# Altium schematic sheet DA +10,-10.SchDoc
size A3; PageSetup: Record=PageOptions|CenterHorizontal=True|CenterVertical=True|PrintScale=1.01|XCorrection=1.00|YCorrection=1.00|PrintKind=1|BorderSize=5000000|LeftOffset=0|BottomOffset=0|Orientation=2|PaperLength=1000|PaperWidth=1000|Scale=100|PaperSource=7|PrintQuality=-4|MediaType=1|DitherType=10|PaperKind=A3|PrintScaleMode=1
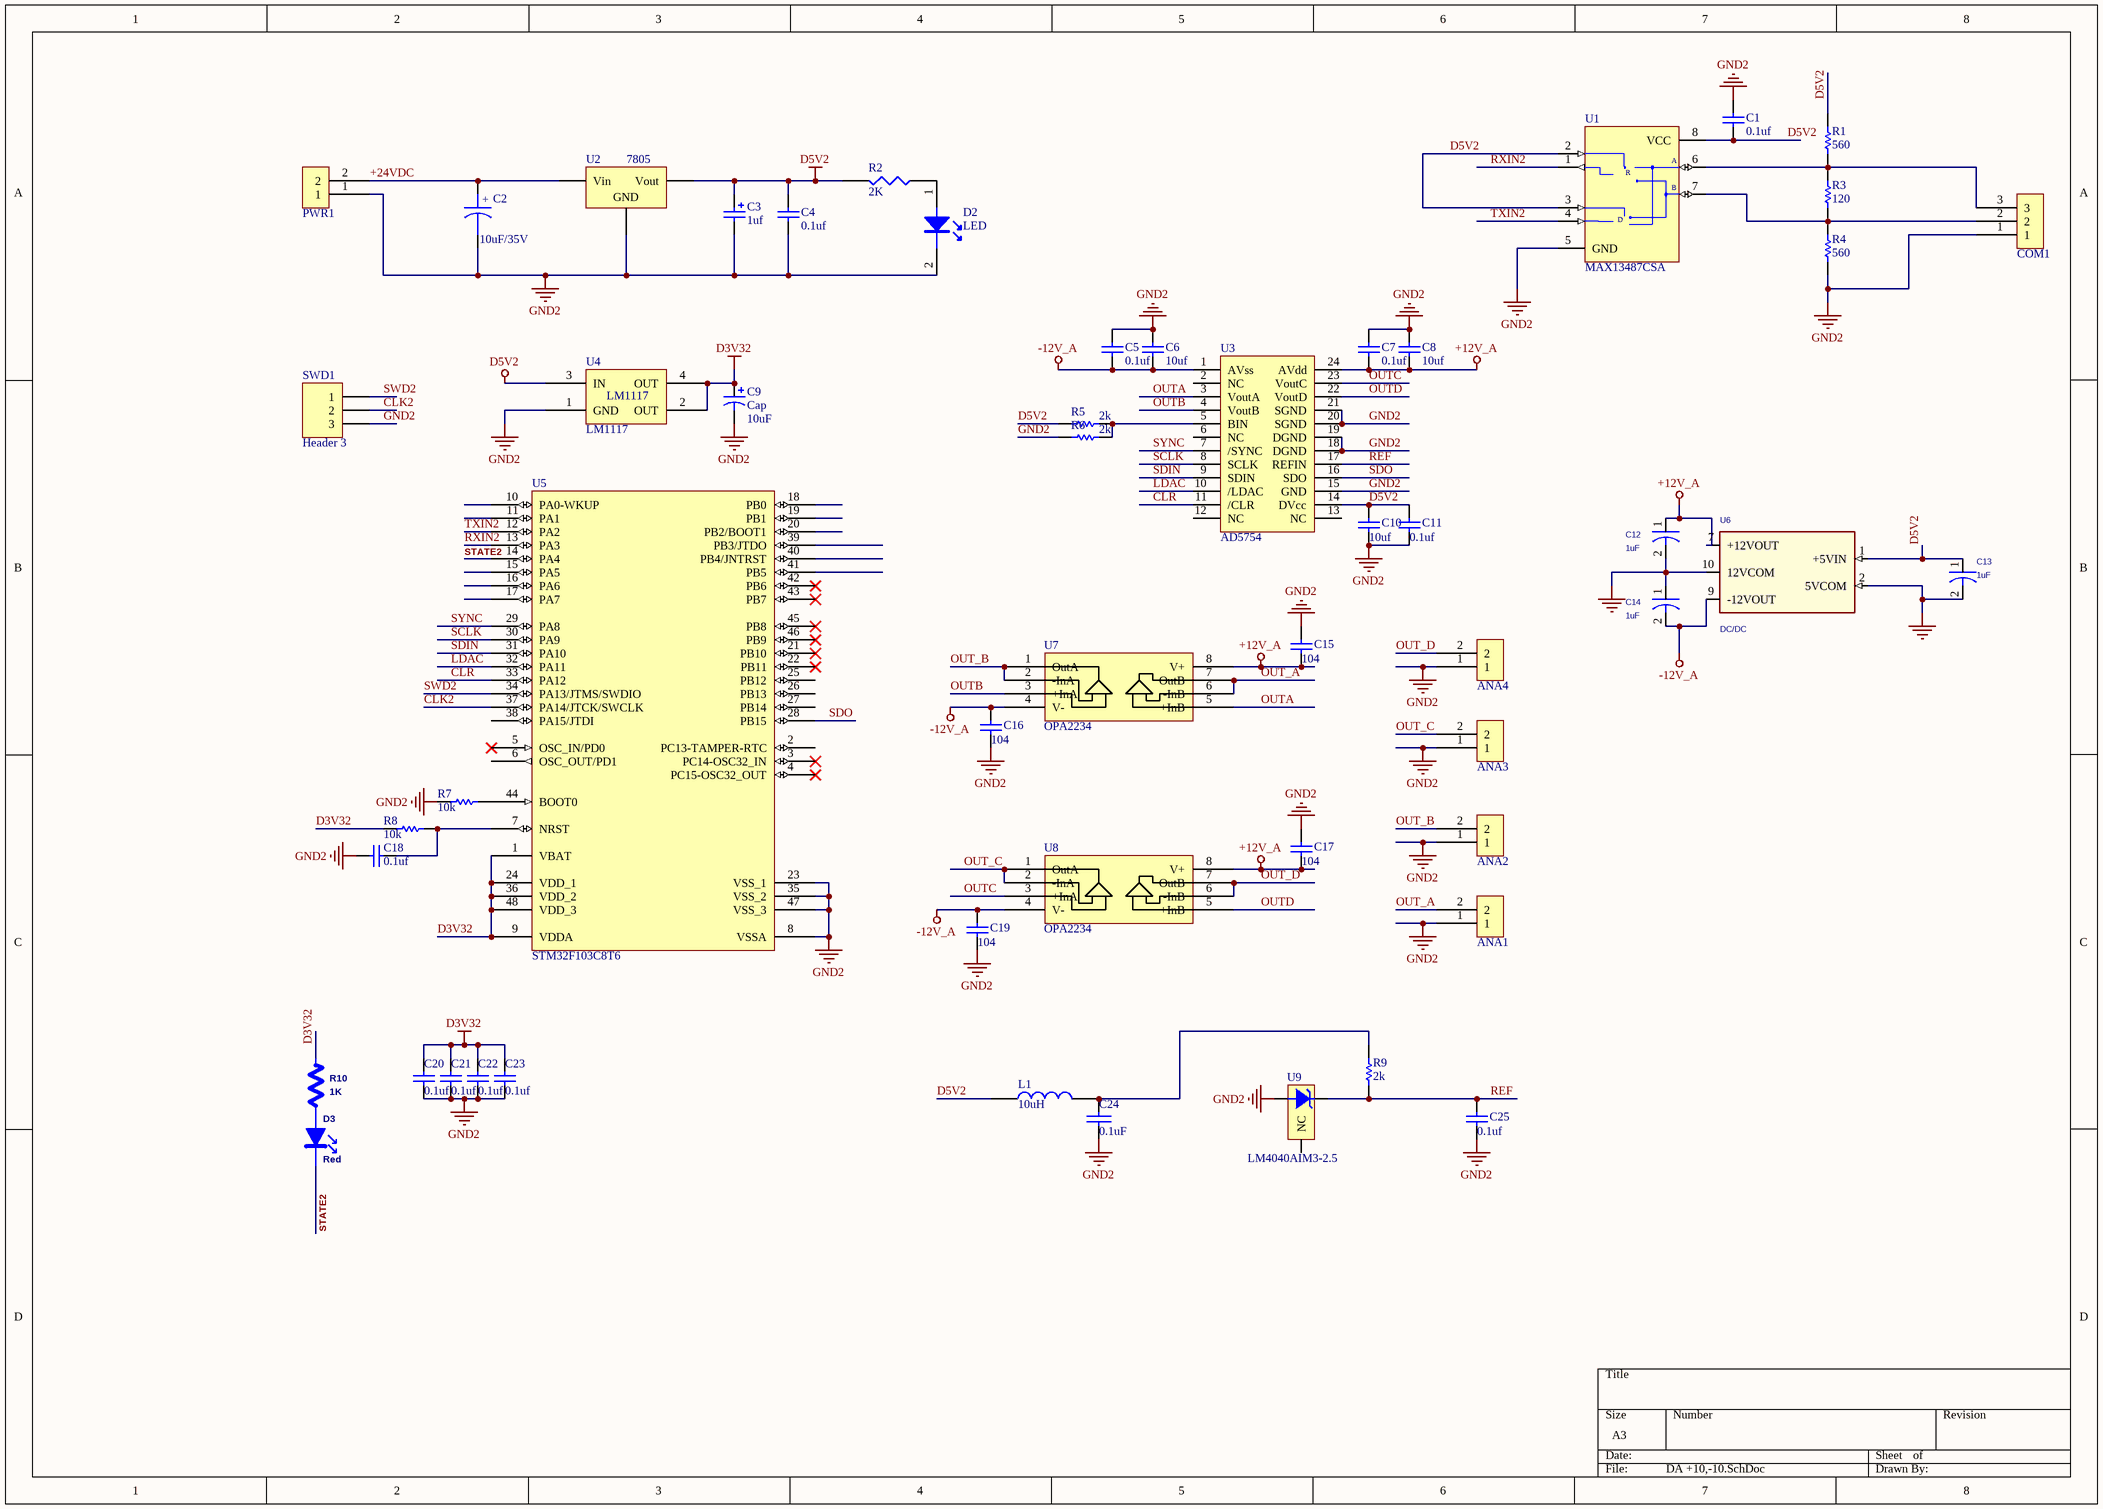
[diagram p0: DA +10,-10.SchDoc]

## Parts
ANA1  HDR1*2_3.81  [2P HEADER 3.81 90]  (value not drawn)
ANA2  HDR1*2_3.81  [2P HEADER 3.81 90]  (value not drawn)
ANA3  HDR1*2_3.81  [2P HEADER 3.81 90]  (value not drawn)
ANA4  HDR1*2_3.81  [2P HEADER 3.81 90]  (value not drawn)
C1  0.1uf  [EIA-0805]
C2  10uF/35V  [BC-CAP 6.6 X5.4]
C3  1uf  [EIA-0805]
C4  0.1uf  [EIA-0805]
C5  value 0.1uf  [EIA-0805]  (hidden comment: 1uf)
C6  value 10uf  [EIA-0805]  (hidden comment: 1uf)
C7  value 0.1uf  [EIA-0805]  (hidden comment: 1uf)
C8  value 10uf  [EIA-0805]  (hidden comment: 1uf)
C9  Cap  value 10uF  [EIA-0805]
C10  value 10uf  [EIA-0805]  (hidden comment: 1uf)
C11  value 0.1uf  [EIA-0805]  (hidden comment: 1uf)
C12  1uF  [EIA-0805]
C13  1uF  [EIA-0805]
C14  1uF  [EIA-0805]
C15  value 104  [EIA-0805]  (hidden comment: 1uf)
C16  value 104  [EIA-0805]  (hidden comment: 1uf)
C17  value 104  [EIA-0805]  (hidden comment: 1uf)
C18  0.1uf  [EIA-0805]
C19  value 104  [EIA-0805]  (hidden comment: 1uf)
C20  0.1uf  [EIA-0805]
C21  0.1uf  [EIA-0805]
C22  0.1uf  [EIA-0805]
C23  0.1uf  [EIA-0805]
C24  0.1uF  [EIA-0805]
C25  value 0.1uf  [EIA-0805]  (hidden comment: 1uf)
COM1  HDR1*3_3.81  [3P HEADER 3.81 90]  (value not drawn)
D2  LED  [0805_L]
D3  Color: Red  [0805_L]  (hidden comment: BC_LED)
L1  10uH  [C1206]
PWR1  HDR1*2_3.81  [2P HEADER 3.81 90]  (value not drawn)
R1  560  [EIA-0805]
R2  2K  [EIA-0805]
R3  120  [EIA-0805]
R4  560  [EIA-0805]
R5  2k  [EIA-0805]
R6  2k  [EIA-0805]
R7  10k  [EIA-0805]
R8  10k  [EIA-0805]
R9  2k  [EIA-0805]
R10  1K  [EIA-0805]
SWD1  Header 3  [HDR1X3]
U1  MAX13487CSA  [SO8_L]
U2  7805  [TO220]
U3  AD5754  [TSSOP_24]
U4  LM1117  [SOT223_L]
U5  STM32F103C8T6  [PQFP-48-7*7]
U6  DC/DC  [dc-dc 10pin sip]
U7  OPA2234  [SO8_L]
U8  OPA2234  [SO8_L]
U9  LM4040AIM3-2.5  [SOT23_L]

## Nets
+12V_A: C7.1 C8.1 C12.1 C15.2 C17.2 U3.24(AVdd) U6.7(+12VOUT) U7.8(V+) U8.8(V+)
-12V_A: C5.1 C6.1 C14.2 C16.1 C19.1 U3.1(AVss) U6.9(-12VOUT) U7.4(V-) U8.4(V-)
D3V32: C9.1 C20.1 C21.1 C22.1 C23.1 R8.1 R10.2 U4.2(OUT) U4.4(OUT) U5.1(VBAT) U5.9(VDDA) U5.24(VDD_1) U5.36(VDD_2) U5.48(VDD_3)
D5V2: C1.1 C3.1 C4.2 C10.1 C11.1 C13.1 L1.1 R1.1 R2.2 R5.1 U1.2(~{RE}) U1.3(DE) U1.8(VCC) U2.3(Vout) U3.14(DVcc) U4.3(IN) U6.1(+5VIN)
GND2: ANA1.1 ANA2.1 ANA3.1 ANA4.1 C1.2 C2.2 C3.2 C4.1 C5.2 C6.2 C7.2 C8.2 C9.2 C10.2 C11.2 C12.2 C13.2 C14.1 C15.1 C16.2 C17.1 C18.2 C19.2 C20.2 C21.2 C22.2 C23.2 C24.2 C25.2 COM1.1 D2.2 PWR1.1 R4.2 R6.1 R7.1 SWD1.3 U1.5(GND) U2.2(GND) U3.15(GND) U3.18(DGND) U3.19(DGND) U3.20(SGND) U3.21(SGND) U4.1(GND) U5.8(VSSA) U5.23(VSS_1) U5.35(VSS_2) U5.47(VSS_3) U6.2(5VCOM) U6.10(12VCOM) U9.2(-V)
+24VDC: C2.1 PWR1.2 U2.1(Vin)
CLK2: SWD1.2 U5.37(PA14/JTCK/SWCLK)
CLR: U3.11(/CLR) U5.33(PA12)
LDAC: U3.10(/LDAC) U5.32(PA11)
OUT_A: ANA1.2 U7.6(-InB) U7.7(OutB)
OUT_B: ANA2.2 U7.1(OutA) U7.2(-InA)
OUT_C: ANA3.2 U8.1(OutA) U8.2(-InA)
OUT_D: ANA4.2 U8.6(-InB) U8.7(OutB)
OUTA: U3.3(VoutA) U7.5(+InB)
OUTB: U3.4(VoutB) U7.3(+InA)
OUTC: U3.23(VoutC) U8.3(+InA)
OUTD: U3.22(VoutD) U8.5(+InB)
REF: C25.1 R9.2 U3.17(REFIN) U9.1(+V)
RXIN2: U1.1(RO) U5.13(PA3)
SCLK: U3.8(SCLK) U5.30(PA9)
SDIN: U3.9(SDIN) U5.31(PA10)
SDO: U3.16(SDO) U5.28(PB15)
STATE2: D3.2 U5.14(PA4)
SWD2: SWD1.1 U5.34(PA13/JTMS/SWDIO)
SYNC: U3.7(/SYNC) U5.29(PA8)
TXIN2: U1.4(DI) U5.12(PA2)
NetC18_1: C18.1 R8.2 U5.7(NRST)
NetC24_1: C24.1 L1.2 R9.1
NetCOM1_2: COM1.2 R3.2 R4.1 U1.7(B)
NetCOM1_3: COM1.3 R1.2 R3.1 U1.6(A)
NetD2_1: D2.1 R2.1
NetD3_1: D3.1 R10.1
NetR5_2: R5.2 R6.2 U3.5(BIN)
NetR7_2: R7.2 U5.44(BOOT0)

Not connected (* = marked no-connect by the designer): U3 2(NC) 6(NC) 12(NC) 13(NC); U5 2(PC13-TAMPER-RTC) 3(PC14-OSC32_IN)* 4(PC15-OSC32_OUT)* 5(OSC_IN/PD0)* 6(OSC_OUT/PD1) 10(PA0-WKUP) 11(PA1) 15(PA5) 16(PA6) 17(PA7) 18(PB0) 19(PB1) 20(PB2/BOOT1) 21(PB10)* 22(PB11)* 25(PB12) 26(PB13) 27(PB14) 38(PA15/JTDI) 39(PB3/JTDO) 40(PB4/JNTRST) 41(PB5) 42(PB6)* 43(PB7)* 45(PB8)* 46(PB9)*; U9 3(NC)

## Notes on the sheet
- (in symbol CAPACITOR POL) +
- (in symbol MAX485CSA) R; D

## Library data of the parts
C1 C18 C20-C23 = Cap: Capacitor; Value: 100pF; Published: 8-Jun-2000; LatestRevisionDate: 17-Jul-2002; LatestRevisionNote: Re-released for DXP Platform.; PackageReference: RAD-0.3; Publisher: Altium Limited
C2 = CAPACITOR POL: Capacitor
C3 = CAP
C4 = CAP Y1
C5-C8 C10 C11 C15-C17 C19 C25 = Cap: Capacitor; Published: 8-Jun-2000; LatestRevisionDate: 17-Jul-2002; LatestRevisionNote: Re-released for DXP Platform.; PackageReference: RAD-0.3; Publisher: Altium Limited
C9 = Cap Pol1: Polarized Capacitor (Radial); Published: 8-Jun-2000; LatestRevisionDate: 17-Jul-2002; LatestRevisionNote: Re-released for DXP Platform.; PackageReference: RB7.6-15; Publisher: Altium Limited
C12-C14 = CAP: Mfgrs Part Num: ECJ-3YB1E105K; Part Number: CAP-500525; Manufacturer: Panasonic; Rating: 25; Tolerance: 10%; Composition: CER X7R
C24 = CAP: Capacitor
D3 = BC_LED: Current Limit: 20mA; Package: LED0805
L1 = INDUCTOR
R1 R3-R9 = Res1: Resistor; Value: 1K; Published: 8-Jun-2000; LatestRevisionDate: 17-Jul-2002; LatestRevisionNote: Re-released for DXP Platform.; PackageReference: AXIAL-0.3; Publisher: Altium Limited
R2 = RES1
R10 = BC_R: Pricision: 1%; Package: R0805; Value: 1K
SWD1 = Header 3: Header, 3-Pin; LatestRevisionDate: 17-Jul-2002; LatestRevisionNote: Re-released for DXP Platform.; Publisher: Altium Limited
U1 = MAX485CSA: Low-Power, Slew-Rate-Limited RS-485/RS-422 Transceiver; Published: 16-Jan-2001; LatestRevisionDate: 13-Apr-2006; LatestRevisionNote: IPC-7351 Footprint Added.; DatasheetVersion: Feb-1996; PackageReference: NSO8; Publisher: Altium Limited; PackageDescription: 8-Pin Small Outline Integrated Circuit 1.27 mm Pitch; Code_JEDEC: MS-012-AA; Code_IPC: SOIC127P600-8; ComponentLink1Description: Manufacturer Link; ComponentLink1URL: http://www.maxim-ic.com/; ComponentLink2Description: Datasheet; ComponentLink2URL: http://pdfserv.maxim-ic.com/en/ds/MAX1487-MAX491.pdf
U2 = Volt Reg: Voltage Regulator; Published: 24-Mar-1999; LatestRevisionDate: 29-May-2009; LatestRevisionNote: IPC-7351 Footprint Added.; PackageReference: D2PAK; Publisher: Altium Limited; PackageDescription: 3-Pin Transistor Outline Package 2.54 mm Pitch, 15.1 mm Lead Span
U5 = STM32F103C8T6: STM32 ARM-based 32-bit MCU with 64 Kbytes Flash, 48-pin LQFP, Industrial Temperature; Published: 30-May-2008; DatasheetVersion: rev6, Mar-2008; PackageVersion: Mar-2008; PackageReference: LQFP48; Publisher: Altium Limited; PackageDescription: 48-Pin Low-Profile Quad Flat Pack, 7 x 7 mm Body, 0.5 mm Pitch (LQFP48); ComponentLink1Description: Manufacturer Link; ComponentLink1URL: www.st.com/stm32; ComponentLink2Description: Datasheet; ComponentLink2URL: http://www.st.com/stonline/products/literature/ds/13587.pdf
U6 = DC/DC-051212_0: Manufacturer: Power One; Part Number: ASY-503927; Mfgrs Part Num: DSP1N5D12; Rating: +/-12V OUT 0.75W; Composition: 5V IN
U9 = LM4040AIM3-2.5: Precision Micropower Shunt Voltage Reference; Manufacturer: National Semiconductor; CompType: Voltage Reference IC; PackageTopMarking: R2A*XTT; PowerWise: N; Published: 4-Dec-2008; DatasheetVersion: Apr-2005; PackageVersion: revB, Mar-2003; PackageReference: MF03A; Publisher: Altium Limited; PackageDescription: Molded SOT-23, .115 x .051 x .037in Body, 3 Lead, .075 in Pitch; PartNumber: LM4040AIM3-2.5; RoHS: O; PinCount: 3; DigiKeyPartNumber: LM4040AIM3-2.5CT-ND; ComponentLink1Description: LM4040 Datasheet; ComponentLink1URL: http://www.national.com/ds/LM/LM4040.pdf; ComponentLink2Description: LM4040 Web Page; ComponentLink2URL: http://www.national.com/pf/LM/LM4040.html; ComponentLink3Description: MF03A Package Page; ComponentLink3URL: http://www.national.com/packaging/folders/mf03a.html